# EasyEDA Pro project DRV8701电机驱动.eprj

# Schematic Schematic1
Create Date: 2023-03-23; Page Name: P1; Project Name: DRV8701电机驱动; Schematic Name: Schematic1; Update Date: 2023-03-24; Company: 嘉立创EDA; Page Size: A4; Version: V1.0
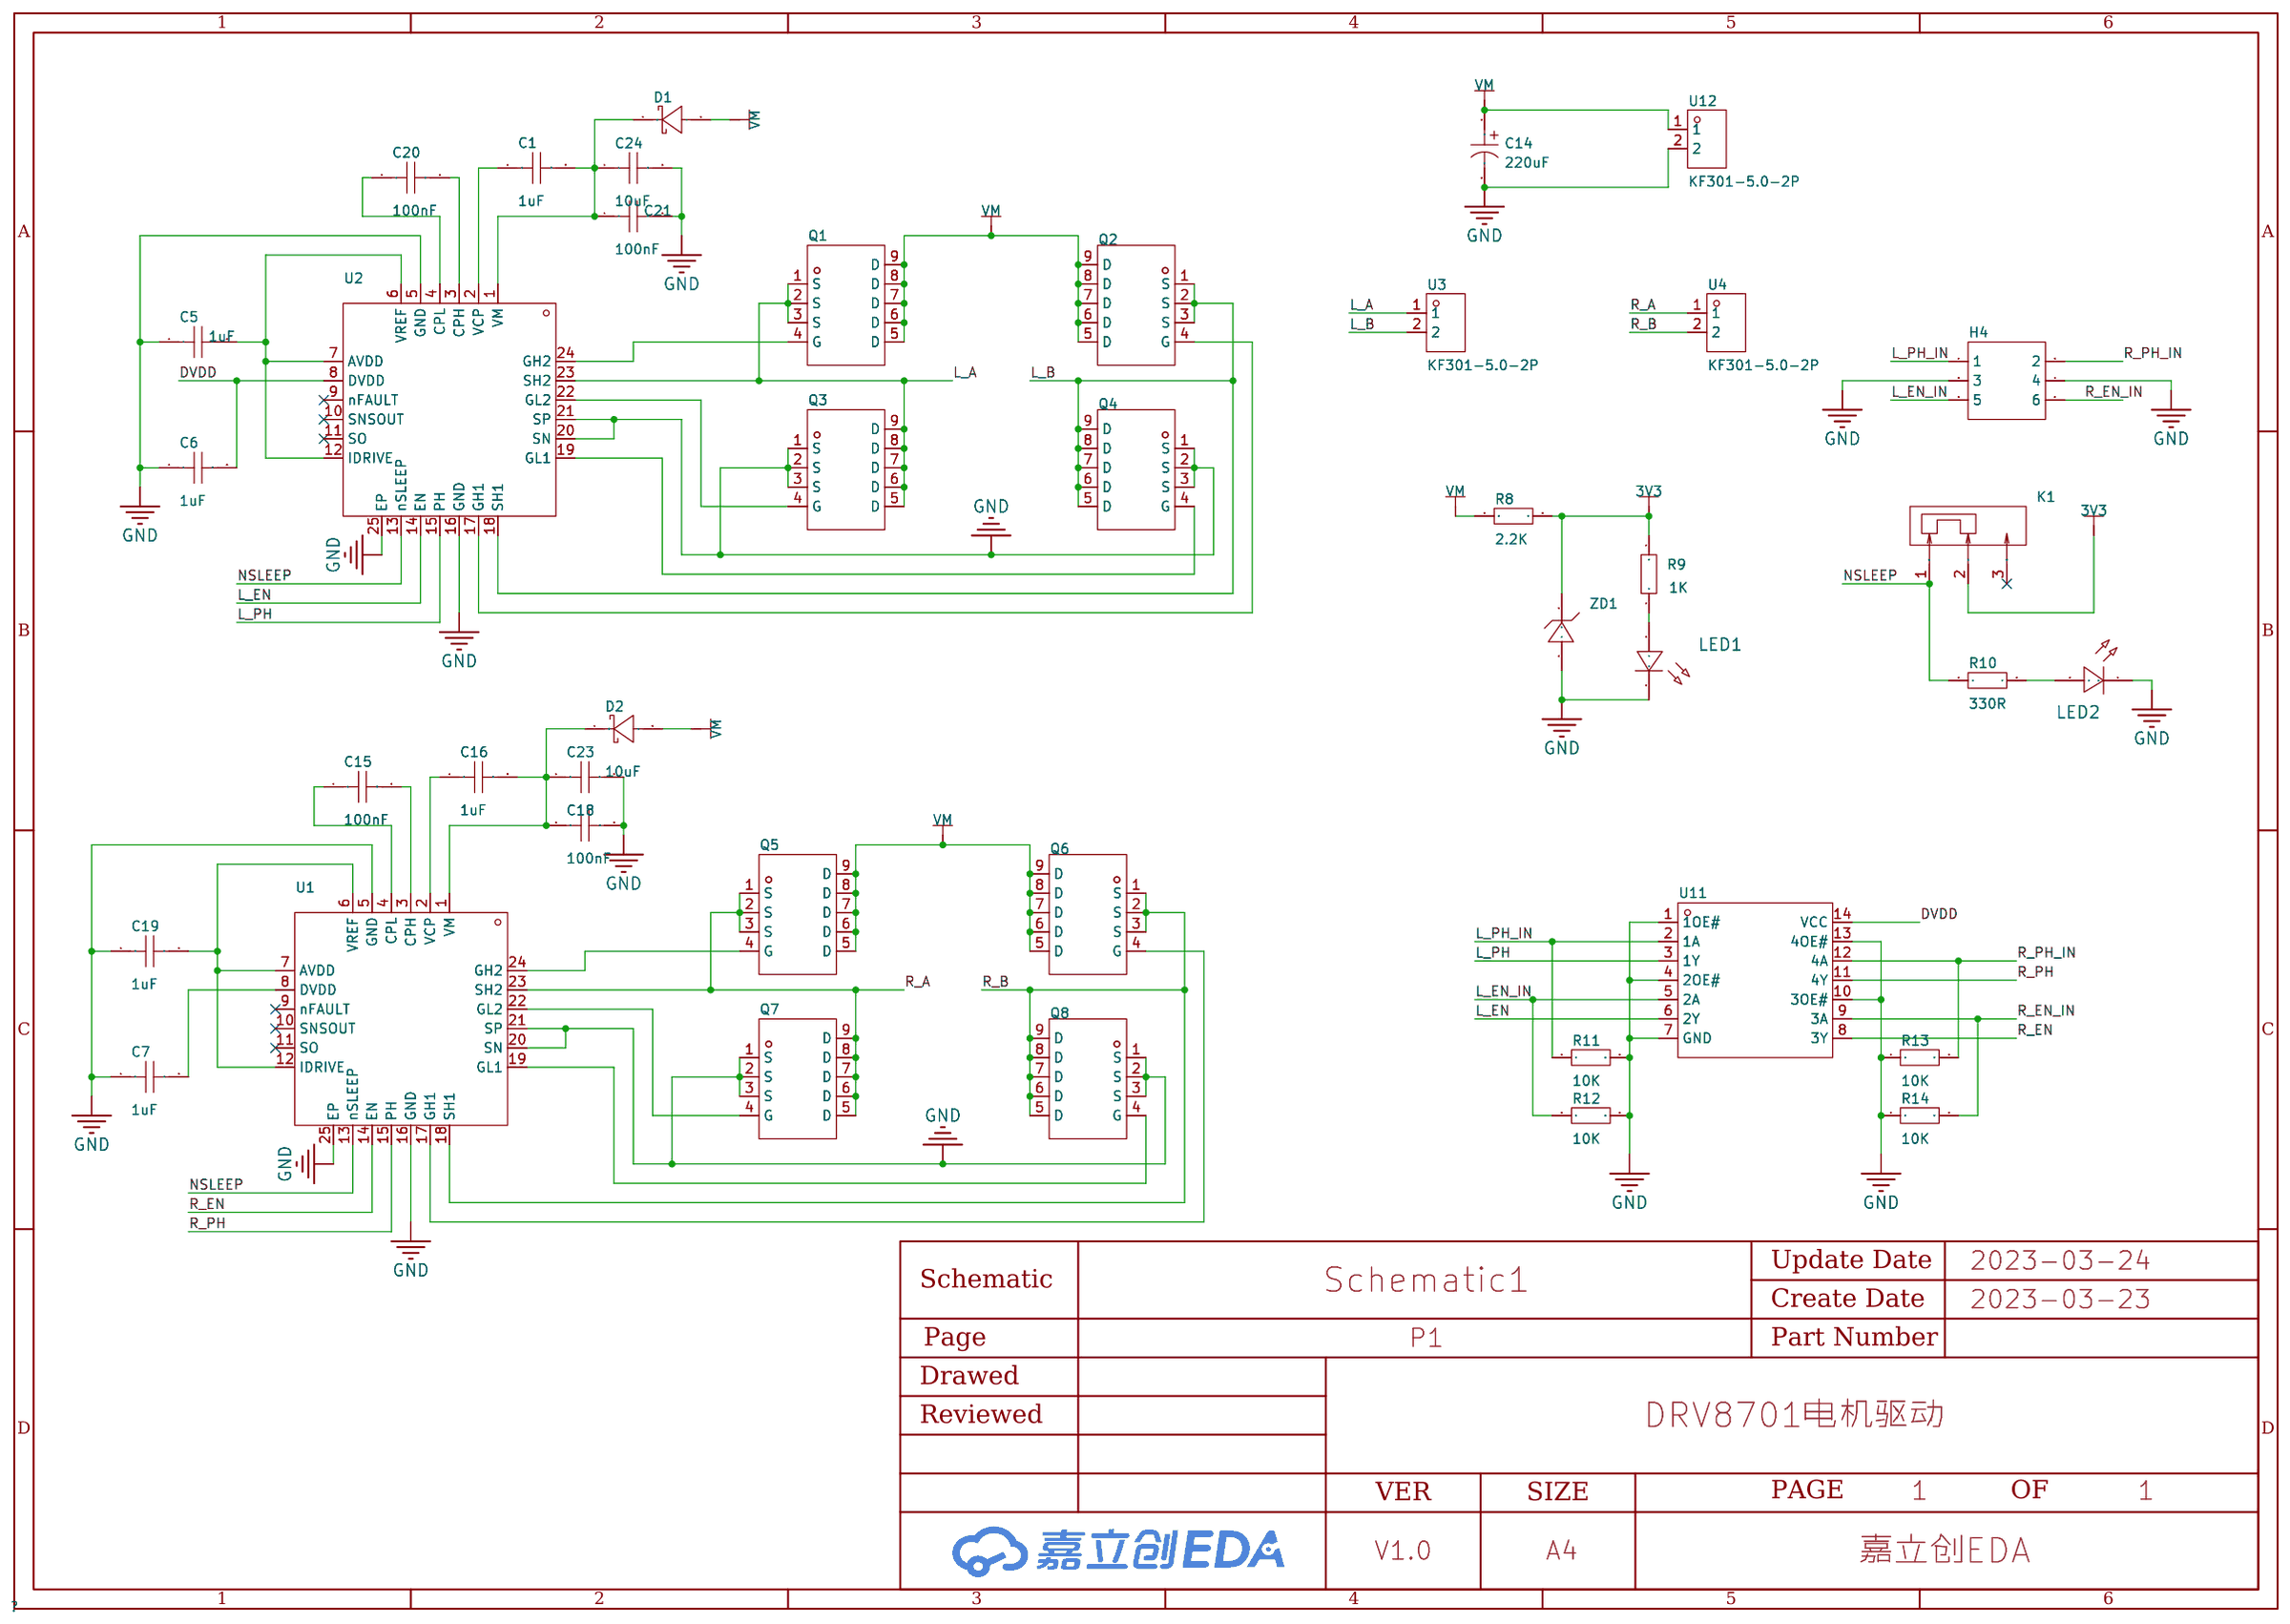
[diagram p0: schematic sheet]

## Parts
C1  1uF  [C0603]
C5  1uF  [C0603]
C6  1uF  [C0603]
C7  1uF  [C0603]
C14  220uF  [CAP-SMD_BD6.3-L6.6-W6.6-LS7.2-FD]
C15  100nF  [C0603]
C16  1uF  [C0603]
C18  100nF  [C0603]
C19  1uF  [C0603]
C20  100nF  [C0603]
C21  100nF  [C0603]
C23  10uF  [C0805]
C24  10uF  [C0805]
D1  1N5819WS  [SOD-323_L1.6-W1.3-LS2.7-RD]
D2  1N5819WS  [SOD-323_L1.6-W1.3-LS2.7-RD]
H4  -  [HDR-TH_6P-P2.54-V-F-R2-C3-S2.54]
K1  -  [SW-TH_SS-12D10-G050]
LED1  -  [LED0603-RD_BLUE]
LED2  -  [LED0603-RD_BLUE]
Q1  TPH1R403NL  [DSOP-8_L5.0-W5.0-P1.27-LS6.0-BL-EP]
Q2  TPH1R403NL  [DSOP-8_L5.0-W5.0-P1.27-LS6.0-BL-EP]
Q3  TPH1R403NL  [DSOP-8_L5.0-W5.0-P1.27-LS6.0-BL-EP]
Q4  TPH1R403NL  [DSOP-8_L5.0-W5.0-P1.27-LS6.0-BL-EP]
Q5  TPH1R403NL  [DSOP-8_L5.0-W5.0-P1.27-LS6.0-BL-EP]
Q6  TPH1R403NL  [DSOP-8_L5.0-W5.0-P1.27-LS6.0-BL-EP]
Q7  TPH1R403NL  [DSOP-8_L5.0-W5.0-P1.27-LS6.0-BL-EP]
Q8  TPH1R403NL  [DSOP-8_L5.0-W5.0-P1.27-LS6.0-BL-EP]
R8  2.2K  [R0603]
R9  1K  [R0603]
R10  330R  [R0603]
R11  10K  [R0603]
R12  10K  [R0603]
R13  10K  [R0603]
R14  10K  [R0603]
U1  DRV8701ERGET  [VQFN-24_L4.0-W4.0-P0.50-LS4.0-BL-EP]
U2  DRV8701ERGET  [VQFN-24_L4.0-W4.0-P0.50-LS4.0-BL-EP]
U3  KF301-5.0-2P  [CONN-TH_P5.00_KF301-5.0-2P]
U4  KF301-5.0-2P  [CONN-TH_P5.00_KF301-5.0-2P]
U11  SN74HC125PWR  [TSSOP-14_L5.0-W4.4-P0.65-LS6.5-BL]
U12  KF301-5.0-2P  [CONN-TH_P5.00_KF301-5.0-2P]
ZD1  BZT52C3V3  [SOD-123_L2.8-W1.8-LS3.7-RD]

## Library data of the parts
C1 C5-C7 C15 C16 C18-C21 = CAP_0603: Supplier Footprint: 0603
C14 = MVG 16V 220UF 6.3*7.7: 容值:220uF;精度:±20%;额定电压:16V;电容体直径:6.3mm;电容体长度:7.7mm;纹波电流:130mA@120Hz;等效串联电阻:-;工作寿命:2000hrs@85℃;工作温度:-40℃~+85℃;; LCSC Part Name: 220uF ±20% 16V; Supplier Part: C2827940; Manufacturer: SAMYOUNG(韩国三莹); Supplier Footprint: SMD,6.3x7.7mm; JLCPCB Part Class: 扩展库; Datasheet: https://atta.szlcsc.com/upload/public/pdf/source/20210425/C2827940_BA294F4A0B6335BFB3E0A33EED85EEAA.pdf; Supplier: LCSC; Tolerance: ±20%; Rated Voltage: 16V; φD: 6.3mm; L: 7.7mm; Ripple Current: 130mA@120Hz; Lifetime @ Temp: 2000hrs@85℃; Operating Temperature: -40℃~+85℃
C23 C24 = CAP_0805: Supplier Footprint: 0805
D1 D2 = 1N5819WS_C1884554: 二极管配置:独立式;直流反向耐压(Vr):40V;平均整流电流(Io):-;正向压降(Vf):600mV@200mA;反向电流(Ir):5A@30V;; LCSC Part Name: 40V 600mV@200mA; Supplier Part: C1884554; Manufacturer: YFW佑风微; Supplier Footprint: SOD-323; JLCPCB Part Class: 扩展库; Datasheet: https://atta.szlcsc.com/upload/public/pdf/source/20210111/C1884554_4EBD9497399E51FFCDCB2BD4F6DDA6EC.pdf; Supplier: LCSC; Diode Configuration: 独立式; Reverse Voltage (Vr): 40V; Forward Voltage (Vf@If): 600mV@200mA; Reverse Leakage Current (Ir): 5A@30V
H4 = HDR-F_2.54_2x3: Supplier Part: C92272; Supplier Footprint: 插件
K1 = SS-12D10-G5: LCSC Part Name: 插件大电流拨动开关; Supplier Part: C2998777; Manufacturer: DEALON(德艺隆); Supplier Footprint: 插件; Datasheet: https://atta.szlcsc.com/upload/public/pdf/source/20220428/E10CB334ACBAF32CF4AF8D87DA871CD3.pdf; Supplier: LCSC
LED1 LED2 = LED_0603-R: 发光颜色:红灯;二极管配置:-;透镜颜色:无色透明;主波长:617.5nm;峰值波长:632nm;色温:-;光通量(25时):-;测试电流:5mA;正向电压(VF):2.2V;发光强度:28.5mcd;功率:60mW;发光角度:120°;安装方式:-;工作温度:-40~+85;; Supplier Footprint: 0603; Supplier Part: C72044
Q1-Q8 = TPH1R403NL_C83440: 类型:N沟道;漏源电压(Vdss):30V;连续漏极电流(Id):150A;功率(Pd):64W;导通电阻(RDS(on)@Vgs,Id):1.4mΩ@10V,30A;阈值电压(Vgs(th)@Id):2.3V@500A;; LCSC Part Name: N沟道 30V 150A; Supplier Part: C83440; Manufacturer: TOSHIBA(东芝); Supplier Footprint: SOP Advance; JLCPCB Part Class: 扩展库; Datasheet: https://atta.szlcsc.com/upload/public/pdf/source/20170908/C83440_1504870121708958077.pdf; Supplier: LCSC; Type: N沟道; Drain Source Voltage (Vdss): 30V; Continuous Drain Current (Id): 150A; Power Dissipation (Pd): 64W; Drain Source On Resistance (RDS(on)@Vgs,Id): 1.4mΩ@10V,30A; Gate Threshold Voltage (Vgs(th)@Id): 2.3V@500A
R8-R14 = Res_0603: Supplier Footprint: 0603
U1 U2 = DRV8701ERGET: DRV8701 DRV8701 H 桥栅极驱动器; Supplier Part: C132049; Manufacturer: TI(德州仪器); Supplier Footprint: VQFN-24; JLCPCB Part Class: 扩展库; Datasheet: https://atta.szlcsc.com/upload/public/pdf/source/20170925/C132049_1506321643935990409.pdf; Supplier: LCSC
U3 U4 U12 = KF301-5.0-2P: 间距:5mm;排数:1;每排PIN数:2;安装方式:直针;额定电流:17A;额定电压:250V;线规 - AWG:14~22;线规 - mm?:1.5;工作温度范围:-30℃~+120℃;颜色:蓝色;; LCSC Part Name: 5mm 排数:1 每排P数:2 直针 可拼接 铜 环保; Supplier Part: C474881; Manufacturer: KEFA(科发); Supplier Footprint: 直插,P=5mm; JLCPCB Part Class: 扩展库; Datasheet: https://atta.szlcsc.com/upload/public/pdf/source/20200115/C474881_883EFE2003339C40FD1BEEEFC9A18423.pdf; Supplier: LCSC; Pitch: 5mm; Number of Rows: 1; Number of PINs Per Row: 2; Mounting Style: 直针; Current Rating (Max): 17A; Voltage Rating (Max): 250V; Wire Gauge - AWG: 14~22; Wire Gauge - mm?: 1.5; Operating Temperature Range: -30℃~+120℃; Color: 蓝色
U11 = SN74HC125PWR: 逻辑电路的归属系列:74HC;逻辑类型:缓冲器，非反向;元件数:4;每元件位数:1;; Supplier Part: C132994; Manufacturer: TI(德州仪器); Supplier Footprint: TSSOP-14; JLCPCB Part Class: Extended Part; Datasheet: https://atta.szlcsc.com/upload/public/pdf/source/20170930/C132994_1506736365150997346.pdf; Supplier: LCSC; Series: 74HC; Logic Type: 缓冲器，非反向; Number of Elements: 4; Number of Bits per Element: 1; Output Type: 三态; Current - Output High, Low: 7.8mA、7.8mA; Voltage - Supply: 2V ~ 6V; Operating Temperature: -40~+85（TA）
ZD1 = BZT52C3V3_C2112: 二极管配置:独立式;稳压值(标称值):3.3V;稳压值(范围):3.1V~3.5V;精度:-;功率:350mW;反向电流(Ir):5A@1V;阻抗(Zzt):95Ω;; LCSC Part Name: 3.3V 350mW; Supplier Part: C2112; Manufacturer: CJ（江苏长电/长晶）; Supplier Footprint: SOD-123; JLCPCB Part Class: 扩展库; Datasheet: https://atta.szlcsc.com/upload/public/pdf/source/20170919/C2112_1505799672426977594.pdf; Supplier: LCSC; Diode Configuration: 独立式; Zener Voltage (Nom): 3.3V; Zener Voltage (Range): 3.1V~3.5V; Power Dissipation: 350mW; Reverse Leakage Current (Ir): 5A@1V; Zener Impedance (Zzt): 95Ω

## Nets
3V3: K1.2 R8.2 R9.2 ZD1.1(K)
DVDD: C6.2 U2.8(DVDD) U11.14(VCC)
GND: C5.1 C6.1 C7.1 C14.2 C18.2 C19.1 C21.2 C23.2 C24.2 H4.3 H4.4 LED1.1(C) LED2.1(C) Q3.1(S) Q3.2(S) Q3.3(S) Q4.1(S) Q4.2(S) Q4.3(S) Q7.1(S) Q7.2(S) Q7.3(S) Q8.1(S) Q8.2(S) Q8.3(S) R11.2 R12.2 R13.1 R14.1 U1.5(GND) U1.16(GND) U1.20(SN) U1.21(SP) U1.25(EP) U2.5(GND) U2.16(GND) U2.20(SN) U2.21(SP) U2.25(EP) U11.1(1OE#) U11.4(2OE#) U11.7(GND) U11.10(3OE#) U11.13(4OE#) U12.2 ZD1.2(A)
L_A: Q1.1(S) Q1.2(S) Q1.3(S) Q3.5(D) Q3.6(D) Q3.7(D) Q3.8(D) Q3.9(D) U2.23(SH2) U3.1
L_B: Q2.1(S) Q2.2(S) Q2.3(S) Q4.5(D) Q4.6(D) Q4.7(D) Q4.8(D) Q4.9(D) U2.18(SH1) U3.2
L_EN: U2.14(EN) U11.6(2Y)
L_EN_IN: H4.5 R12.1 U11.5(2A)
L_PH: U2.15(PH) U11.3(1Y)
L_PH_IN: H4.1 R11.1 U11.2(1A)
NSLEEP: K1.1 R10.1 U1.13(nSLEEP) U2.13(nSLEEP)
R_A: Q5.1(S) Q5.2(S) Q5.3(S) Q7.5(D) Q7.6(D) Q7.7(D) Q7.8(D) Q7.9(D) U1.23(SH2) U4.1
R_B: Q6.1(S) Q6.2(S) Q6.3(S) Q8.5(D) Q8.6(D) Q8.7(D) Q8.8(D) Q8.9(D) U1.18(SH1) U4.2
R_EN: U1.14(EN) U11.8(3Y)
R_EN_IN: H4.6 R14.2 U11.9(3A)
R_PH: U1.15(PH) U11.11(4Y)
R_PH_IN: H4.2 R13.2 U11.12(4A)
VM: C14.1 D1.2(A) D2.2(A) Q1.5(D) Q1.6(D) Q1.7(D) Q1.8(D) Q1.9(D) Q2.5(D) Q2.6(D) Q2.7(D) Q2.8(D) Q2.9(D) Q5.5(D) Q5.6(D) Q5.7(D) Q5.8(D) Q5.9(D) Q6.5(D) Q6.6(D) Q6.7(D) Q6.8(D) Q6.9(D) R8.1 U12.1
$1N1153: C5.2 U2.6(VREF) U2.7(AVDD) U2.12(IDRIVE)
$1N1161: C20.2 U2.3(CPH)
$1N1197: Q4.4(G) U2.19(GL1)
$1N1201: Q2.4(G) U2.17(GH1)
$1N2092: C16.2 C18.1 C23.1 D2.1(C) U1.1(VM)
$1N2101: Q7.4(G) U1.22(GL2)
$1N2104: Q5.4(G) U1.24(GH2)
$1N2107: C16.1 U1.2(VCP)
$1N2109: C15.1 U1.4(CPL)
$1N2133: C19.2 U1.6(VREF) U1.7(AVDD) U1.12(IDRIVE)
$1N2141: C15.2 U1.3(CPH)
$1N2177: Q8.4(G) U1.19(GL1)
$1N2181: Q6.4(G) U1.17(GH1)
$1N2566: C7.2 U1.8(DVDD)
$1N3270: C1.1 U2.2(VCP)
$1N3271: C20.1 U2.4(CPL)
$1N3281: Q3.4(G) U2.22(GL2)
$1N3282: Q1.4(G) U2.24(GH2)
$1N14620: C1.2 C21.1 C24.1 D1.1(C) U2.1(VM)
Net-(LED1-2): LED1.2(A) R9.1
Net-(LED2-2): LED2.2(A) R10.2

Not connected (* = marked no-connect by the designer): K1 3*; U1 9(nFAULT)* 10(SNSOUT)* 11(SO)*; U2 9(nFAULT)* 10(SNSOUT)* 11(SO)*

# Board PCB1
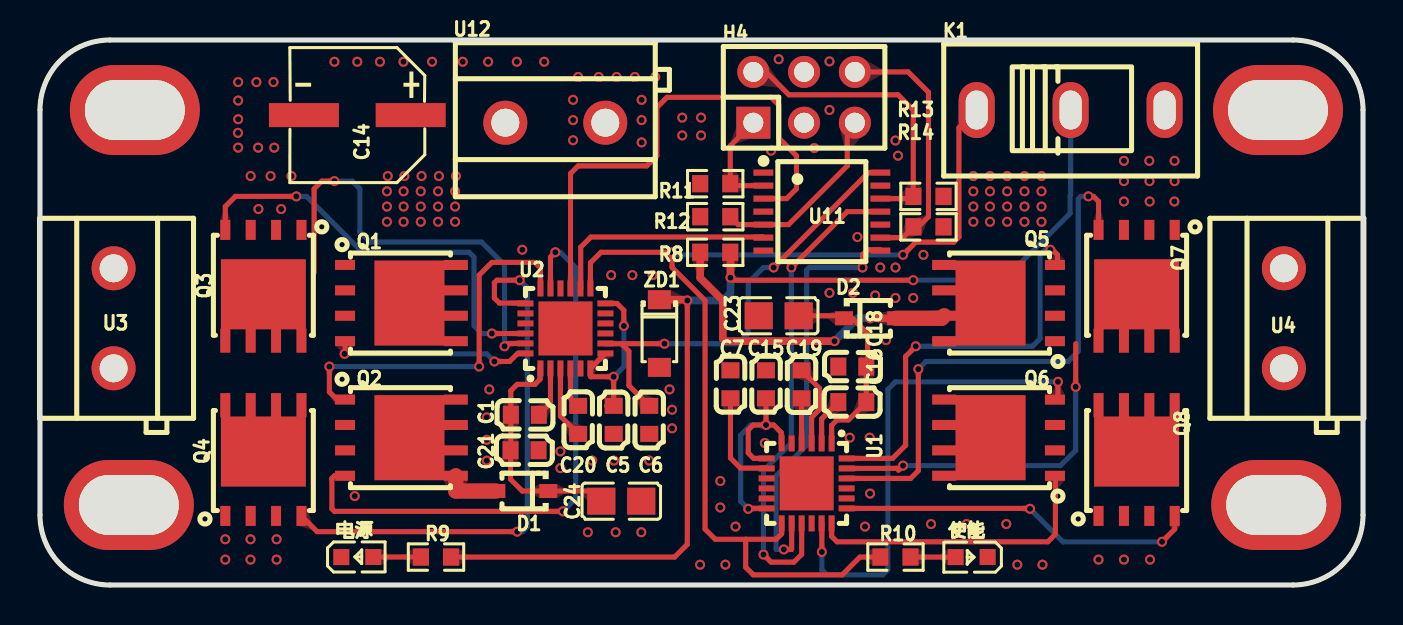
[diagram p1: board, top side]
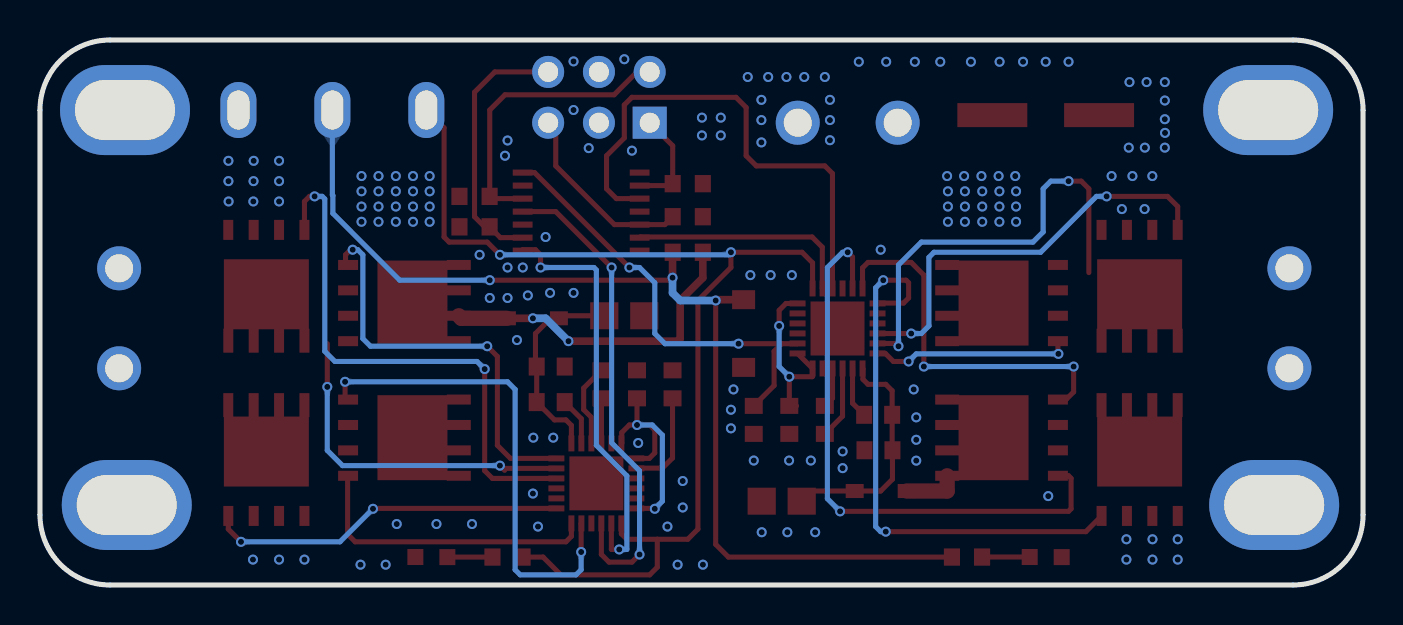
[diagram p2: board, bottom side, seen from below]

Outline 66.19 x 27.25 mm; copper layers: Top Layer, Bottom Layer. Coordinates in mm from the lower left corner of the outline.
Outline path: 0,23.75 0,3.5 arc(1.03,1.03) 3.5,0 62.69,0 arc(65.16,1.03) 66.19,3.5 66.19,23.75 arc(65.16,26.22) 62.69,27.25 3.5,27.25 arc(1.03,26.22) 0,23.75
Stack: Top Layer 0.035mm / Dielectric1 1.51mm FR4 er 4.5 / Bottom Layer 0.035mm

## Design rules (mm)
spacing safeClearance (default): track to track 0.152, other pairs 0.152 to 0.3
track width trackWidth (default): min 0.127, default 0.254, max 2.54
differential pair differentialPair (default): width min 0.127, default 0.254, max 2.54; gap min 0.152, default 0.152
via viaSize (default): diameter min 0.5, default 0.61, max 10; hole min 0.3, default 0.305, max 6

## Placement (name value [footprint] x y rotation side)
C1  1uF  [C0603]  24.26 8.51 180 top
C5  1uF  [C0603]  28.7 8.25 90 top
C6  1uF  [C0603]  30.48 8.25 90 top
C7  1uF  [C0603]  34.54 10.03 270 top
C14  220uF  [CAP-SMD_BD6.3-L6.6-W6.6-LS7.2-FD]  15.88 23.5 180 top
C15  100nF  [C0603]  38.1 10.03 90 top
C16  1uF  [C0603]  40.64 9.14 0 top
C18  100nF  [C0603]  40.64 10.92 180 top
C19  1uF  [C0603]  36.32 10.03 270 top
C20  100nF  [C0603]  26.92 8.25 270 top
C21  100nF  [C0603]  24.24 6.74 0 top
C23  10uF  [C0805]  36.96 13.46 180 top
C24  10uF  [C0805]  29.08 4.19 0 top
D1  1N5819WS  [SOD-323_L1.6-W1.3-LS2.7-RD]  24.13 4.7 180 top
D2  1N5819WS  [SOD-323_L1.6-W1.3-LS2.7-RD]  41.53 13.33 0 top
H4  -  [HDR-TH_6P-P2.54-V-F-R2-C3-S2.54]  38.23 24.38 0 top
K1  -  [SW-TH_SS-12D10-G050]  51.56 23.75 0 top
NOREF  -  [Pad_e340]  61.94 23.75 0 top
NOREF#2  -  [Pad_e334]  4.75 23.75 0 top
NOREF#3  -  [Pad_e336]  4.44 4 0 top
NOREF#4  -  [Pad_e345]  61.85 4 0 top
Q1  TPH1R403NL  [DSOP-8_L5.0-W5.0-P1.27-LS6.0-BL-EP]  18.03 14.1 270 top
Q2  TPH1R403NL  [DSOP-8_L5.0-W5.0-P1.27-LS6.0-BL-EP]  18.03 7.37 270 top
Q3  TPH1R403NL  [DSOP-8_L5.0-W5.0-P1.27-LS6.0-BL-EP]  11.18 14.99 180 top
Q4  TPH1R403NL  [DSOP-8_L5.0-W5.0-P1.27-LS6.0-BL-EP]  11.18 6.22 0 top
Q5  TPH1R403NL  [DSOP-8_L5.0-W5.0-P1.27-LS6.0-BL-EP]  48.01 14.1 90 top
Q6  TPH1R403NL  [DSOP-8_L5.0-W5.0-P1.27-LS6.0-BL-EP]  48.01 7.37 90 top
Q7  TPH1R403NL  [DSOP-8_L5.0-W5.0-P1.27-LS6.0-BL-EP]  54.86 14.99 180 top
Q8  TPH1R403NL  [DSOP-8_L5.0-W5.0-P1.27-LS6.0-BL-EP]  54.86 6.22 0 top
R8  2.2K  [R0603]  33.78 16.64 0 top
R9  1K  [R0603]  19.81 1.4 0 top
R10  330R  [R0603]  42.8 1.4 0 top
R11  10K  [R0603]  33.78 20.07 180 top
R12  10K  [R0603]  33.78 18.42 180 top
R13  10K  [R0603]  44.45 19.43 180 top
R14  10K  [R0603]  44.45 17.91 180 top
U1  DRV8701ERGET  [VQFN-24_L4.0-W4.0-P0.50-LS4.0-BL-EP]  38.35 5.08 180 top
U2  DRV8701ERGET  [VQFN-24_L4.0-W4.0-P0.50-LS4.0-BL-EP]  26.29 12.83 0 top
U3  KF301-5.0-2P  [CONN-TH_P5.00_KF301-5.0-2P]  3.68 13.33 270 top
U4  KF301-5.0-2P  [CONN-TH_P5.00_KF301-5.0-2P]  62.23 13.33 270 top
U11  SN74HC125PWR  [TSSOP-14_L5.0-W4.4-P0.65-LS6.5-BL]  39.12 18.67 270 top
U12  KF301-5.0-2P  [CONN-TH_P5.00_KF301-5.0-2P]  25.78 23.11 0 top
ZD1  BZT52C3V3  [SOD-123_L2.8-W1.8-LS3.7-RD]  30.99 12.57 270 top
使能  -  [LED0603-RD_BLUE]  46.61 1.4 180 top
电源  -  [LED0603-RD_BLUE]  15.88 1.4 0 top

## Footprints (pads in the part's own frame, mm; a bottom-side part is the same pattern mirrored in y, then rotated)
C0603
  rect 0.8x0.9 smd: 1(-0.7,0) 2(0.7,0)
C0805
  rect 1.41x1.35 smd: 1(-1,0) 2(1,0)
CAP-SMD_BD6.3-L6.6-W6.6-LS7.2-FD
  rect 3.5x1.2 smd: 1(-2.67,0) 2(2.67,0)
CONN-TH_P5.00_KF301-5.0-2P
  round 2.2 hole 1.4: 1(-2.5,0) 2(2.5,0)
DSOP-8_L5.0-W5.0-P1.27-LS6.0-BL-EP
  rect 0.5x1 smd: 1(-1.905,-2.77) 2(-0.635,-2.77) 3(0.634,-2.77) 4(1.905,-2.77)
  rect 0.5x1.2 smd: 5(1.905,2.77) 6(0.635,2.77) 7(-0.634,2.77) 8(-1.905,2.77)
  custom 4.25x3.5 smd: 9(0,0.45)
HDR-TH_6P-P2.54-V-F-R2-C3-S2.54
  rect 1.7x1.6 hole 1: 1(-2.54,-1.27)
  round 1.6 hole 1: 2(-2.54,1.27) 3(0,-1.27) 4(0,1.27) 5(2.54,-1.27) 6(2.54,1.27)
LED0603-RD_BLUE
  rect 0.8x0.8 smd: 1(-0.8,-0.003) 2(0.8,0.003)
Pad_e334
  oval 6.5x4.5 hole 5x3: 1(0,0)
Pad_e336
  oval 6.5x4.5 hole 5x3: 1(0,0)
Pad_e340
  oval 6.5x4.5 hole 5x3: 1(0,0)
Pad_e345
  oval 6.5x4.5 hole 5x3: 1(0,0)
R0603
  rect 0.806x0.864 smd: 1(-0.753,0) 2(0.753,0)
SOD-123_L2.8-W1.8-LS3.7-RD
  rect 0.95x1.15 smd: 1(-1.692,0) 2(1.692,0)
SOD-323_L1.6-W1.3-LS2.7-RD
  rect 0.899x0.701 smd: 1(-1.3,0) 2(1.3,0)
SW-TH_SS-12D10-G050
  oval 1.8x2.8 hole 1.1x1.95: 1(-4.7,0) 2(0,0) 3(4.7,0)
TSSOP-14_L5.0-W4.4-P0.65-LS6.5-BL
  rect 0.305x0.991 smd: 1(-1.95,-2.926) 2(-1.3,-2.926) 3(-0.65,-2.926) 4(0,-2.926) 5(0.65,-2.926) 6(1.3,-2.926) 7(1.95,-2.926) 8(1.95,2.926) 9(1.3,2.926) 10(0.65,2.926) 11(0,2.926) 12(-0.65,2.926) 13(-1.3,2.926) 14(-1.95,2.926)
VQFN-24_L4.0-W4.0-P0.50-LS4.0-BL-EP
  rect 0.3x0.8 smd: 1(-1.25,-2) 2(-0.75,-2) 3(-0.251,-2) 4(0.25,-2) 5(0.75,-2) 6(1.25,-2) 13(1.25,2) 14(0.75,2) 15(0.249,2) 16(-0.25,2) 17(-0.75,2) 18(-1.25,2)
  rect 0.8x0.3 smd: 7(2.001,-1.25) 8(2.001,-0.75) 9(2.001,-0.249) 10(2.001,0.251) 11(2.001,0.751) 12(2.001,1.25) 19(-2.001,1.25) 20(-2.001,0.75) 21(-2.001,0.251) 22(-2.001,-0.248) 23(-2.001,-0.749) 24(-2.001,-1.249)
  rect 2.7x2.7 smd: 25(0.001,-0.002)

## Nets
As in the schematic, except:
GND: C5.1 C6.1 C7.1 C14.2 C18.2 C19.1 C21.2 C23.2 C24.2 H4.3 H4.4 Q3.1 Q3.2 Q3.3 Q4.1 Q4.2 Q4.3 Q7.1 Q7.2 Q7.3 Q8.1 Q8.2 Q8.3 R11.2 R12.2 R13.1 R14.1 U1.5 U1.16 U1.20 U1.21 U1.25 U2.5 U2.16 U2.20 U2.21 U2.25 U11.1 U11.4 U11.7 U11.10 U11.13 U12.2 ZD1.2 使能.1 电源.1
$1N2273: R10.2 使能.2
$1N2360: R9.1 电源.2

Pads without a net: K1 3; NOREF 1; NOREF#2 1; NOREF#3 1; NOREF#4 1; U1 9 10 11; U2 9 10 11

## Via types
v1: diameter 0.5, hole 0.305, Top Layer to Bottom Layer, 187 vias

## Routing (per net, layer and track width the routed paths; a pad name or vN(x,y) marks a point on that pad's centre or on a via; arc(x,y) is an arc through that point)
3V3: length 53.6
  Top Layer w0.254: v1(34.54,15.37) 34.67,15.24 v1(43.69,15.24) ; v1(32.38,14.22) 32.38,2.03 31.75,1.4 R9.2
  Top Layer w0.381: ZD1.1 32.34,14.27 v1(32.38,14.22) ; R8.2 34.54,16.63 v1(34.54,15.37)
  Bottom Layer w0.254: K1.2 51.56,19.5 51.54,19.47 51.54,18.58 48.19,15.24 v1(43.69,15.24)
  Bottom Layer w0.381: v1(32.38,14.22) 34.16,14.22 34.54,14.61 v1(34.54,15.37)
DVDD: length 22.5
  Top Layer w0.254: 29.08,12.06 v1(31.24,12.06) ; 29.08,12.06 29.46,11.68 29.46,9.97 C6.2 ; 29.08,12.06 28.3,12.06 U2.8 ; v1(36.7,15.88) 41.45,20.62 U11.14
  Bottom Layer w0.254: v1(31.24,12.06) 34.93,12.06 35.43,12.57 35.43,15.11 36.19,15.88 v1(36.7,15.88)
GND:
  vias: v1(9.27,2.29) v1(9.27,1.27) v1(9.92,25.15) v1(9.92,24.22) v1(9.92,23.29) v1(9.91,22.61) v1(9.92,21.87) v1(10.54,20.45) v1(10.53,2.29) v1(10.53,1.27) v1(10.83,25.15) v1(10.92,21.87) v1(10.93,18.8) v1(11.54,20.45) v1(11.68,25.15) v1(11.72,21.87) v1(11.84,2.29) v1(11.84,1.27) v1(12.06,18.8) v1(12.58,20.45) v1(14.73,26.16) v1(15.75,4.44) v1(15.88,26.16) v1(17.01,26.16) v1(18.18,26.16) v1(19.62,26.16) v1(21.15,26.16) v1(22.42,26.16) v1(22.35,8.38) v1(22.35,7.26) v1(22.35,6.22) v1(22.48,9.78) v1(23.86,26.16) v1(24.13,16.76) v1(25.23,26.16) v1(26.03,6.68) v1(26.03,5.84) v1(26.67,24.26) v1(26.67,23.25) v1(26.67,22.24) v1(26.92,25.4) v1(27.41,2.64) v1(27.63,6.22) v1(27.95,25.4) v1(28.57,15.49) v1(28.71,6.22) v1(28.85,25.4) v1(28.8,2.64) v1(29.64,15.49) v1(29.76,25.4) v1(30.1,24.26) v1(30.1,23.25) v1(30.1,22.13) v1(30.08,2.64) v1(30.48,6.22) v1(30.65,15.49) v1(30.78,25.4) v1(31.5,9.78) v1(31.62,8.76) v1(31.62,7.83) v1(32.13,23.37) v1(32.13,22.48) v1(33.02,1.02) v1(33.07,23.37) v1(33.07,22.48) v1(34.03,5.2) v1(34.03,3.88) v1(34.29,1.02) v1(34.8,2.92) v1(36.26,7.1) v1(36.58,21.72) v1(36.96,26.29) v1(38.74,21.84) v1(39.5,26.18) v1(39.5,23.75) v1(39.5,14.61) v1(40.51,7.37) v1(40.67,14.61) v1(40.89,17.4) v1(41.28,2.92) v1(41.51,7.37) v1(41.53,4.57) v1(41.78,14.48) v1(42.04,15.88) v1(42.33,12.25) v1(42.8,22.22) v1(42.8,15.88) v1(42.8,14.35) v1(42.93,21.46) v1(43.69,14.35) v1(44.2,16.51) v1(44.58,3.05) v1(46.35,3.05) v1(48.34,3.05) v1(48.9,1.02) v1(50.15,1.02) v1(52.96,1.27) v1(54.23,21.21) v1(54.23,20.19) v1(54.23,19.18) v1(54.23,1.27) v1(55.5,21.21) v1(55.51,20.19) v1(55.52,19.18) v1(55.53,1.27) v1(56.76,21.21) v1(56.76,20.19) v1(56.75,19.18)
L_A: length 22
  Top Layer w0.254: v1(23.24,11.94) 23.38,12.08 U2.23 ; 13.72,15.62 13.72,19.81 14.1,20.19 v1(14.73,20.19)
  Bottom Layer w0.254: v1(14.73,20.19) 15.62,20.19 16,19.81 16,17.65 16.51,17.14 22.1,17.14 23.24,16 v1(23.24,11.94)
L_B: length 18.8
  Top Layer w0.254: Q2.1 14.86,9.27 14.48,9.65 v1(14.48,10.92) ; v1(21.97,10.92) 21.97,15.49 22.61,16.13 24.76,16.13 25.04,15.85 U2.18
  Bottom Layer w0.254: v1(21.97,10.92) v1(14.48,10.92)
L_EN: length 11.4
  Top Layer w0.254: U2.14 27.05,14.84 27.05,16.89 27.56,17.4 36.16,17.4 U11.6
L_EN_IN: length 9.5
  Top Layer w0.254: H4.5 40.39,22.73 40.39,20.95 37.45,18.02 34.93,18.02 R12.1
L_PH: length 25.7
  Top Layer w0.254: U11.3 37.35,19.32 37.85,19.81 37.85,21.46 36.96,22.35 36.96,24 36.58,24.38 31.37,24.38 30.86,23.88 30.86,21.46 30.35,20.95 26.92,20.95 26.54,20.57 26.54,14.83 U2.15
L_PH_IN: length 5.2
  Top Layer w0.254: H4.1 34.54,21.96 R11.1 34.63,19.97 U11.2
NSLEEP: length 54.9
  Top Layer w0.254: v1(43.18,16.51) 43.81,17.14 45.72,17.14 45.97,17.4 45.97,22.86 K1.1 ; U1.13 37.1,2.56 36.83,2.29 35.31,2.29 ; R10.1 41.02,1.4 40.13,0.51 35.69,0.51 35.31,0.89 35.31,2.29 ; U2.13 27.54,16.11 28.07,16.64 v1(31.62,16.64) 31.62,15.88 33.27,14.22 33.27,2.79 33.78,2.29 35.31,2.29
  Bottom Layer w0.254: v1(43.18,16.51) 31.75,16.51 v1(31.62,16.64)
R_A: length 17.3
  Top Layer w0.254: 43.04,5.83 42.95,5.73 ; 43.04,5.83 U1.23 ; 43.04,5.83 v1(43.18,5.97) ; v1(51.82,9.91) 51.82,12.06
  Bottom Layer w0.254: v1(51.82,9.91) 51.82,6.73 51.05,5.97 v1(43.18,5.97)
R_B: length 15
  Top Layer w0.254: U1.18 39.6,2.43 39.88,2.16 50.42,2.16 50.8,2.54 50.8,5.44 Q6.1
R_EN: length 21.2
  Top Layer w0.254: 42.04,16.76 41.4,16.76 41.15,16.51 v1(41.15,15.88) ; v1(37.21,1.78) 37.59,1.78 37.6,1.79 U1.14 ; U11.8 42.04,16.76
  Bottom Layer w0.254: v1(37.21,1.78) 36.83,1.78 36.83,5.46 38.35,6.98 38.35,15.75 38.48,15.88 v1(41.15,15.88)
R_EN_IN: length 13.2
  Top Layer w0.254: U11.9 43.16,17.37 R14.2 43.94,17.91 44.45,18.42 44.45,24.64 43.43,25.65 H4.6
R_PH: length 24.3
  Top Layer w0.254: U11.11 40.39,18.67 v1(37.59,15.88) ; 38.1,3.08 38.1,1.53 37.72,1.14 36.58,1.14 v1(36.19,1.52)
  Bottom Layer w0.254: v1(36.19,1.52) 36.19,5.72 37.59,7.11 v1(37.59,15.88)
R_PH_IN: length 14.8
  Top Layer w0.254: H4.2 36.32,25.65 37.47,24.51 42.93,24.51 43.69,23.75 43.69,19.44 R13.2 43.59,19.32 U11.12
VM: length 19.2
  Top Layer w0.381: R8.1 33.03,15.36 34.16,14.22 34.16,12.32 34.29,12.19 v1(39.75,12.19) ; v1(41.53,13.33) D2.2
  Top Layer w0.762: D2.2 45.11,13.33 Q5.7 ; Q2.5 20.8,4.7 D1.2
  Bottom Layer w0.381: v1(39.75,12.19) 40.89,13.33 v1(41.53,13.33)
  vias: v1(17.4,20.45) v1(17.36,19.69) v1(17.36,18.92) v1(17.36,18.16) v1(18.23,20.45) v1(18.19,19.69) v1(18.19,18.92) v1(18.19,18.16) v1(19.09,20.45) v1(19.05,19.69) v1(19.05,18.92) v1(19.05,18.16) v1(19.92,19.69) v1(19.92,18.92) v1(19.92,18.16) v1(19.96,20.45) v1(20.81,20.45) v1(20.77,19.69) v1(20.77,18.92) v1(20.77,18.16) v1(46.7,20.45) v1(46.7,19.69) v1(46.7,18.92) v1(46.7,18.16) v1(47.53,20.45) v1(47.53,19.69) v1(47.53,18.92) v1(47.53,18.16) v1(48.39,20.45) v1(48.39,19.69) v1(48.39,18.92) v1(48.39,18.16) v1(49.25,20.45) v1(49.25,19.69) v1(49.25,18.92) v1(49.25,18.16) v1(50.1,20.45) v1(50.1,19.69) v1(50.1,18.92) v1(50.1,18.16)
$1N1153: length 9
  Top Layer w0.254: U2.12 28.87,14.08 29.21,13.73 v1(29.21,12.95) ; U2.7 U2.6 27.54,10.43 27.56,10.41 v1(28.7,10.41) C5.2 28.34,8.95
  Bottom Layer w0.254: v1(29.21,12.95) 29.21,10.92 v1(28.7,10.41)
$1N1161: length 3.6
  Top Layer w0.254: 26.92,7.56 26.04,8.44 U2.3
$1N1197: length 28
  Top Layer w0.254: v1(24,15.24) 22.86,15.24 22.73,15.11 22.73,14.35 22.99,14.1 24.27,14.1 U2.19 ; v1(23.88,2.67) 13.87,2.67 Q4.4
  Bottom Layer w0.254: v1(23.88,2.67) 24.13,2.67 24.38,2.92 24.38,14.86 v1(24,15.24)
$1N1201: length 29.5
  Top Layer w0.254: Q2.4 14.73,5.46 14.6,5.33 14.6,3.81 14.73,3.68 v1(26.16,3.68) ; v1(25.78,16.64) 25.54,16.4 U2.17
  Bottom Layer w0.254: v1(26.16,3.68) 26.8,4.32 26.8,15.88 26.03,16.64 v1(25.78,16.64)
$1N2092: length 10.6
  Top Layer w0.254: D2.1 40.42,13.33 ; 40.42,13.33 40.64,13.33 41.4,12.57 41.4,10.98 C18.1 C16.2 40.45,8.25 39.88,8.25 39.6,7.98 U1.1 ; 40.42,13.33 40.29,13.46 C23.1
$1N2101: length 27.4
  Top Layer w0.254: v1(43.94,10.8) 43.94,5.72 43.56,5.33 U1.22 ; v1(52.45,19.43) 52.71,19.43 52.96,19.18 Q7.4
  Bottom Layer w0.254: v1(52.45,19.43) 52.07,19.43 51.94,19.3 51.94,11.68 51.44,11.18 44.32,11.18 v1(43.94,10.8)
$1N2104: length 20.6
  Top Layer w0.254: v1(43.81,11.94) 43.31,11.43 43.31,6.98 42.65,6.33 U1.24 ; v1(50.55,16.76) 50.65,16.76 50.9,16.51 50.9,16.13 Q5.4
  Bottom Layer w0.254: v1(43.81,11.94) 49.66,11.94 50.04,12.32 50.04,16.51 50.29,16.76 v1(50.55,16.76)
$1N2107: length 2.4
  Top Layer w0.254: C16.1 39.1,8.31 U1.2
$1N2109: length 2.3
  Top Layer w0.254: U1.4 38.1,7.08 C15.1
$1N2133: length 12.6
  Top Layer w0.254: v1(36.32,8) 36.7,8 37.08,7.62 37.08,7.1 U1.6 ; v1(36.32,8) 35.69,8 35.43,7.75 35.43,6.6 35.71,6.33 U1.7 ; v1(36.32,8) 36.32,9.14 ; U1.12 35.45,3.83 v1(35.43,3.81) ; 36.32,9.14 C19.2 36.26,9.33 36.19,9.27 36.32,9.14
  Bottom Layer w0.254: v1(35.43,3.81) 35.05,4.19 35.05,7.49 35.56,8 v1(36.32,8)
$1N2141: length 4.2
  Top Layer w0.254: U1.3 38.6,8.38 38.99,8.77 38.99,9.84 C15.2
$1N2177: length 18
  Top Layer w0.254: v1(56.13,2.16) 56.77,2.79 Q8.4 ; v1(49.53,3.81) 49.51,3.83 U1.19
  Bottom Layer w0.254: v1(56.13,2.16) 51.18,2.16 v1(49.53,3.81)
$1N2181: length 24.5
  Top Layer w0.254: v1(39.12,1.65) 39.12,3.07 U1.17 ; v1(50.93,10.16) 50.93,9.42 Q6.4
  Bottom Layer w0.254: v1(50.93,10.16) 42.8,10.16 42.42,9.78 42.42,0.76 42.16,0.51 39.37,0.51 39.12,0.76 v1(39.12,1.65)
$1N2273: length 2.3
  Top Layer w0.254: R10.2 45.81,1.4 使能.2
$1N2360: length 2.4
  Top Layer w0.254: 电源.2 19.06,1.4 R9.1
$1N2566: length 5
  Top Layer w0.254: U1.8 36.34,5.84 35.05,5.84 34.54,6.35 C7.2
$1N3270: length 2.6
  Top Layer w0.254: U2.2 25.54,9.09 C1.1
$1N3271: length 2
  Top Layer w0.254: C20.1 26.54,9.34 U2.4
$1N3281: length 21.2
  Top Layer w0.254: Q3.4 9.27,18.92 9.78,19.43 v1(12.83,19.43) ; U2.22 24.28,12.57 v1(22.61,12.57)
  Bottom Layer w0.254: v1(22.61,12.57) 22.1,12.57 21.72,12.95 21.72,16.38 21.46,16.64 16.13,16.64 13.34,19.43 v1(12.83,19.43)
$1N3282: length 10
  Top Layer w0.254: v1(15.24,11.56) 15.26,11.58 Q1.4 ; v1(22.73,11.18) 23.5,11.18 23.9,11.58 U2.24
  Bottom Layer w0.254: v1(15.24,11.56) 22.35,11.56 v1(22.73,11.18)
$1N14620: length 11.7
  Top Layer w0.254: C24.1 27.57,4.7 D1.1 24.13,4.7 23.54,5.29 C21.1 23.56,6.75 23.56,9.71 23.88,10.03 24.76,10.03 25.02,10.29 25.02,10.81 U2.1

## Copper pours and planes (outline as drawn; the poured copper is in the pictures)
GND on Top Layer: -0.76,28.32 66.8,28.32 66.8,-0.64 -0.76,-0.64
GND on Bottom Layer: -2.03,30.35 68.45,30.35 68.45,-1.78 -2.03,-1.78
L_A on Top Layer: 1.52,18.67 1.02,18.16 1.02,14.1 1.52,13.59 7.34,13.59 7.93,13 7.93,11.38 8.38,10.92 13.72,10.92 14.22,11.43 14.22,12.57 14.6,12.95 15.75,12.95 16,13.21 16,16.51 15.75,16.76 7.75,16.76 7.49,17.02 7.49,18.29 7.11,18.67
L_B on Top Layer: 1.52,12.95 1.02,12.57 1.02,7.75 1.52,7.24 7.37,7.24 7.87,6.73 7.87,4.95 8.38,4.44 13.59,4.44 14.1,4.95 14.1,5.78 14.54,6.22 15.75,6.22 16,6.48 16,9.95 15.53,10.41 8,10.41 7.37,11.05 7.37,12.58 6.95,13 1.61,13
R_A on Top Layer: 51.82,15.37 52.07,15.62 52.07,16.51 52.32,16.76 57.91,16.76 58.42,17.27 58.42,19.05 58.8,19.43 65.28,19.43 65.66,19.05 65.66,14.1 65.28,13.72 58.78,13.72 58.4,13.33 58.4,11.54 58.17,11.3 50.49,11.3 50.1,11.7 50.1,14.92 50.55,15.37
R_B on Top Layer: 50.42,4.83 50.04,5.19 50.04,8.51 50.25,8.72 51.98,8.72 52.32,9.07 52.32,10.54 52.71,10.92 58.29,10.92 58.93,11.56 58.93,13.08 59.18,13.33 65.33,13.33 65.67,13 65.67,7.25 65.28,6.86 58.29,6.86 57.78,6.35 57.78,5.36 57.16,4.74 50.55,4.7 50.51,4.73
VM on Top Layer: 17.02,25.02 16.38,24.38 16.38,4.95 16.89,4.44 20.96,4.44 21.46,4.95 21.46,19.94 21.97,20.45 25.53,20.45 25.91,20.83 25.91,24.64 25.53,25.02
VM on Top Layer: 46.1,16.64 44.96,16.64 44.45,16.13 44.45,5.08 44.96,4.57 49.28,4.57 49.78,5.08 49.78,16.76 50.42,17.4 50.42,20.95 50.04,21.34 46.74,21.34 46.35,20.95 46.35,16.89
VM on Bottom Layer: 17.4,21.34 16.76,20.9 16.76,17.78 17.02,17.53 49.91,17.53 50.42,18.03 50.42,20.56 49.66,21.33 17.53,21.33

Small or netless copper shapes (teardrops, artwork), in the pictures only: 138 on Top Layer, 36 on Bottom Layer
